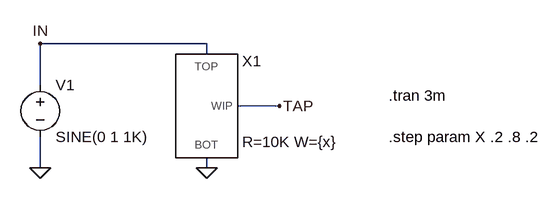
[diagram p0: schematic UsingAsubckt.asc]
UsingAsubckt.asc, the LTspice schematic file:
Version 4
SHEET 1 948 680
WIRE 336 48 80 48
WIRE 336 64 336 48
WIRE 80 112 80 48
WIRE 448 144 384 144
WIRE 80 240 80 192
WIRE 336 240 336 224
FLAG 336 240 0
FLAG 80 240 0
FLAG 448 144 TAP
FLAG 80 48 IN
SYMBOL voltage 80 96 R0
WINDOW 123 0 0 Left 0
WINDOW 39 0 0 Left 0
SYMATTR InstName V1
SYMATTR Value SINE(0 1 1K)
SYMBOL Pot 336 144 R0
WINDOW 0 55 -69 Left 0
WINDOW 39 55 56 Left 0
SYMATTR InstName X1
SYMATTR SpiceLine R=10K W={x}
TEXT 616 128 Left 0 !.tran 3m
TEXT 616 192 Left 0 !.step param X .2 .8 .2

The netlist it stands for:
* UsingAsubckt.asc
V1 IN 0 SINE(0 1 1K)
XX1 0 IN TAP Pot params: R=10K W={x}  ; pins BOT TOP WIP
.tran 3m
.step param X .2 .8 .2
.backanno
.end